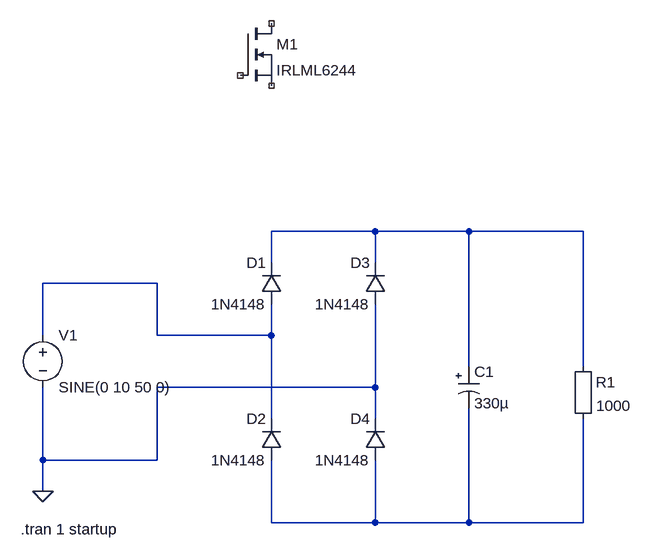
[diagram p0: schematic Draft2.asc]
Draft2.asc, the LTspice schematic file:
Version 4
SHEET 1 880 680
WIRE 256 -240 96 -240
WIRE 400 -240 256 -240
WIRE 576 -240 400 -240
WIRE 96 -192 96 -240
WIRE 256 -192 256 -240
WIRE -80 -160 -256 -160
WIRE -256 -80 -256 -160
WIRE -80 -80 -80 -160
WIRE 96 -80 96 -128
WIRE 96 -80 -80 -80
WIRE 400 -32 400 -240
WIRE 576 -32 576 -240
WIRE 256 0 256 -128
WIRE 256 0 -80 0
WIRE 96 48 96 -80
WIRE 256 48 256 0
WIRE -256 112 -256 0
WIRE -80 112 -80 0
WIRE -80 112 -256 112
WIRE -256 160 -256 112
WIRE 96 208 96 112
WIRE 256 208 256 112
WIRE 256 208 96 208
WIRE 400 208 400 32
WIRE 400 208 256 208
WIRE 576 208 576 48
WIRE 576 208 400 208
FLAG -256 160 0
SYMBOL diode 112 -128 R180
WINDOW 0 24 64 Left 2
WINDOW 3 24 0 Left 2
SYMATTR InstName D1
SYMATTR Value 1N4148
SYMBOL diode 112 112 R180
WINDOW 0 24 64 Left 2
WINDOW 3 24 0 Left 2
SYMATTR InstName D2
SYMATTR Value 1N4148
SYMBOL diode 272 -128 R180
WINDOW 0 24 64 Left 2
WINDOW 3 24 0 Left 2
SYMATTR InstName D3
SYMATTR Value 1N4148
SYMBOL diode 272 112 R180
WINDOW 0 24 64 Left 2
WINDOW 3 24 0 Left 2
SYMATTR InstName D4
SYMATTR Value 1N4148
SYMBOL voltage -256 -96 R0
WINDOW 123 0 0 Left 0
WINDOW 39 0 0 Left 0
SYMATTR InstName V1
SYMATTR Value SINE(0 10 50 0)
SYMBOL polcap 384 -32 R0
WINDOW 3 24 56 Left 2
SYMATTR InstName C1
SYMATTR Value 330µ
SYMATTR Description Capacitor
SYMATTR Type cap
SYMATTR SpiceLine V=25 Irms=795m Rser=0.085 Lser=0 mfg="Nichicon" pn="UPL1E331MPH" type="Al electrolytic"
SYMBOL Misc\\EuropeanResistor 560 -48 R0
WINDOW 0 35 40 Left 2
SYMATTR InstName R1
SYMATTR Value 1000
SYMBOL nmos 48 -560 R0
SYMATTR InstName M1
SYMATTR Value IRLML6244
TEXT -290 218 Left 2 !.tran 1 startup

The netlist it stands for:
* Draft2.asc
D1 N002 N001 1N4148
D2 N003 N002 1N4148
D3 0 N001 1N4148
D4 N003 0 1N4148
V1 N002 0 SINE(0 10 50 0)
C1 N001 N003 330µ V=25 Irms=795m Rser=0.085 Lser=0 mfg="Nichicon" pn="UPL1E331MPH" type="Al electrolytic"
R1 N001 N003 1000
M1 NC_01 NC_02 NC_03 NC_03 IRLML6244
.model D D
.lib standard.dio
.model NMOS NMOS
.model PMOS PMOS
.lib standard.mos
.tran 1 startup
.backanno
.end